# EAGLE schematic timer 555 (EAGLE 7.2.0)
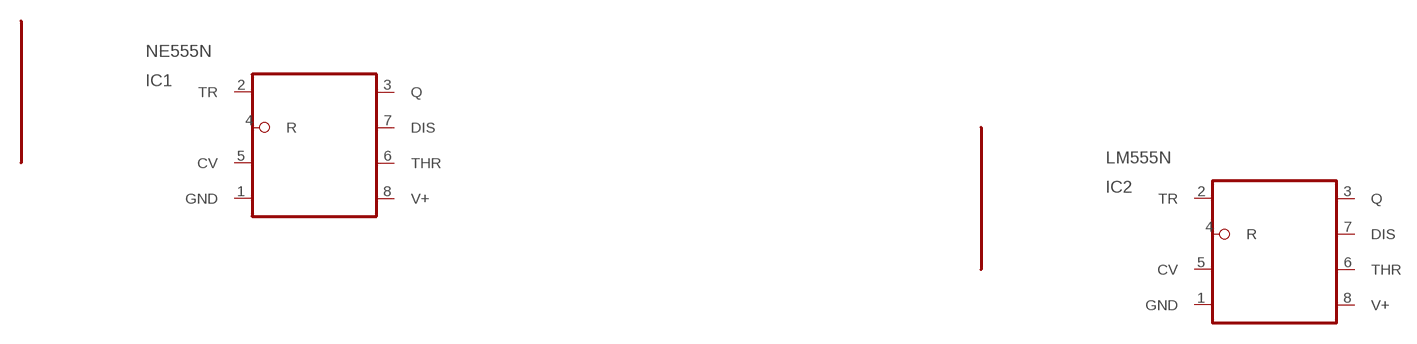
[diagram p0: schematic, sheet 1]

## Parts
IC1  NE555N  [DIL08]
IC2  LM555N  [DIL08]
Unconnected: IC1.2(TR) IC1.3(Q) IC1.4(R) IC1.5(CV) IC1.6(THR) IC1.7(DIS) IC2.2(TR) IC2.3(Q) IC2.4(R) IC2.5(CV) IC2.6(THR) IC2.7(DIS)

## Power pins joined to a net without a drawn wire
GND: IC1.1(GND) IC2.1(GND)
V+: IC1.8(V+) IC2.8(V+)

## Library data of the parts
IC1 IC2 = linear:*555: TIMER